# Altium schematic sheet PCA_0011_Mini Breakout_REV_B.SchDoc
size A4; DrawnBy: Philip Rowse
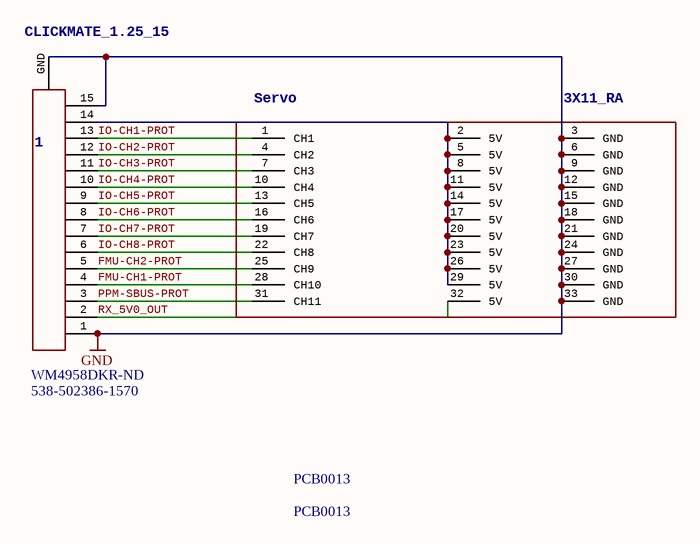
[diagram p0: PCA_0011_Mini Breakout_REV_B.SchDoc]

## Parts
1  CLICKMATE_1.25_15  Supplier Part Number 1: WM4958DKR-ND  Supplier Part Number 2: 538-502386-1570  [CLICKMATE_H15]
PCB0013  PCB0013
Servo  3X11_RA  [3X11RA]

## Nets
GND: 1.1 1.15 1.GND Servo.3(GND) Servo.6(GND) Servo.9(GND) Servo.12(GND) Servo.15(GND) Servo.18(GND) Servo.21(GND) Servo.24(GND) Servo.27(GND) Servo.30(GND) Servo.33(GND)
FMU-CH1-PROT: 1.4 Servo.28(CH10)
FMU-CH2-PROT: 1.5 Servo.25(CH9)
IO-CH1-PROT: 1.13 Servo.1(CH1)
IO-CH2-PROT: 1.12 Servo.4(CH2)
IO-CH3-PROT: 1.11 Servo.7(CH3)
IO-CH4-PROT: 1.10 Servo.10(CH4)
IO-CH5-PROT: 1.9 Servo.13(CH5)
IO-CH6-PROT: 1.8 Servo.16(CH6)
IO-CH7-PROT: 1.7 Servo.19(CH7)
IO-CH8-PROT: 1.6 Servo.22(CH8)
PPM-SBUS-PROT: 1.3 Servo.31(CH11)
RX_5V0_OUT: 1.2 Servo.32(5V)
Net1_14: 1.14 Servo.2(5V) Servo.5(5V) Servo.8(5V) Servo.11(5V) Servo.14(5V) Servo.17(5V) Servo.20(5V) Servo.23(5V) Servo.26(5V) Servo.29(5V)

## Notes on the sheet
- Title:
- Date:
- Time:
- Sheet:
- Approved:
- of:
- Drawn By:
- Checked By:
- 3DRobotics

## Library data of the parts
1 = CLICKMATE_1.25_15: Connector, Receptacle, 15Pos, 1.25MM, R/A, SMD, Tin; 3DR_PARTNO: ECM0530; Supplier 1: Digi-Key; Supplier 2: Mouser
PCB0013 = PCB_0013: PCB,clickmate 15 to 0.1" adaptor board,Board; 3DR_PARTNO: PCB0013; VALUE: PCB0013
Servo = 3X11_RA: 11 x 3 RA Servo header, gold plated.; PARTNO: 894-80-042-20-001101; 3DR_PARTNO: UNKNOWN